# Altium project racecar_shiftlight.PrjPcb
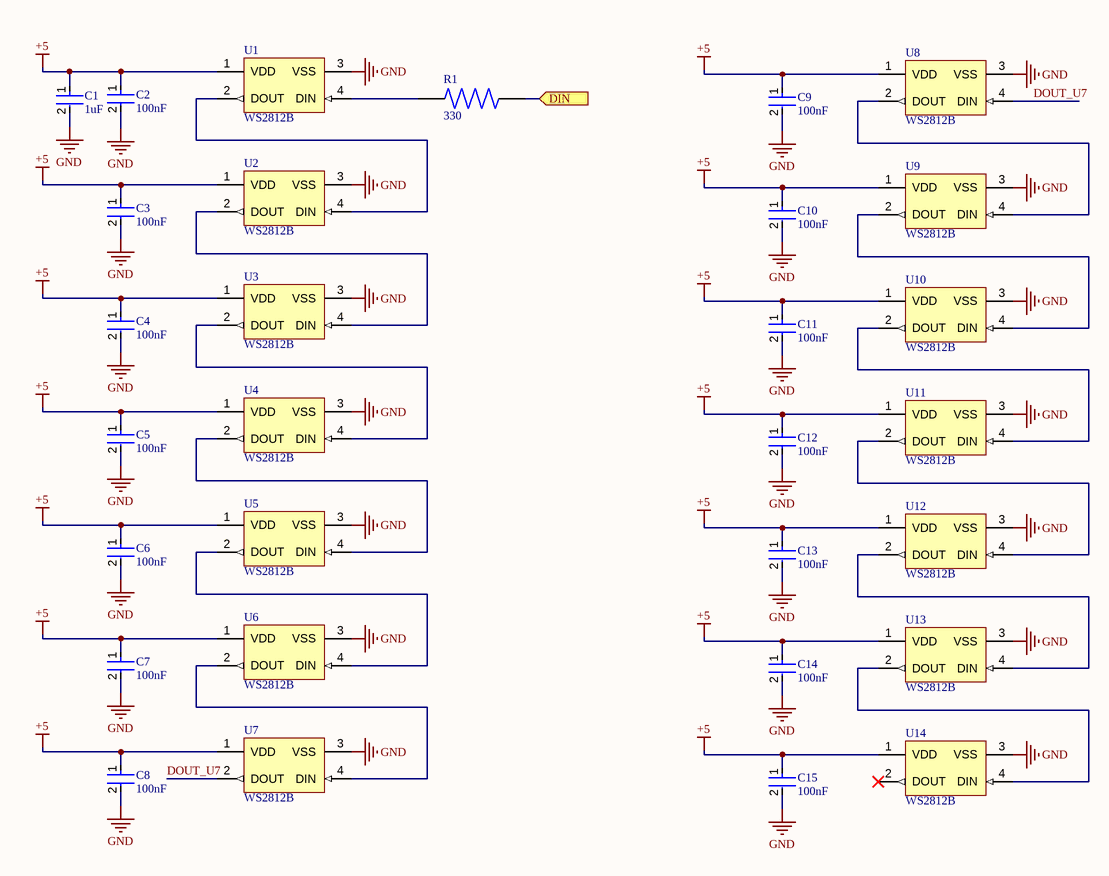
[diagram p0: ws2812b.SchDoc]
CAGE_CODE: ?????; CONTRACT_NUMBER: <CONTRACT NO>; DOC_NO_ASSY_DWG: <ASSY DWG NO>; DOC_NO_BOM: <BOM DOC NO>; DOC_NO_FAB_DWG: <FAB DWG NO>; DOC_NO_SCH_DWG: <SCH DWG NO>; PCB_2_DEC_TOL: +/-.01; PCB_3_DEC_TOL: +/-.010; PCB_ANG_TOL: +/-1/2; PCB_ASSEMBLY_NO: <PCB ASSY NO>; PCB_CHECKER: - -----; PCB_CHECKER_APP_DATE: --/--/----; PCB_DESIGNER: - -----; PCB_DESIGNER_APP_DATE: --/--/----; PCB_DWG_NO: <PCB DWG NO>; PCB_ENGINEER: - -----; PCB_ENGINEER_APP_DATE: --/--/----; PCB_PART_NUMBER: <PCB PN>; PCB_REV: A; SCH_REV: A
3 sheets, 53 parts. Net scope: flat (ports and power ports of the same name join across sheets).
Board file: PCB1.PcbDoc
Sheets:
  ws2812b.SchDoc
  7_seg_display.SchDoc
  connectors_and_mosfets.SchDoc

## Sheet ws2812b.SchDoc: WS2812B
size Letter; Author: Lin Fu; SheetNumber: 1; SheetTotal: 3; ENG_APP_DATE: --/--/--; DSN_APP_DATE: --/--/--; CHK_APP_DATE: --/--/--

### Parts
C1  1uF  [FP-CGA3E-0_3-0_1-IPC_A]
C2  100nF  [FP-CL10-IPC_A]
C3  100nF  [FP-CL10-IPC_A]
C4  100nF  [FP-CL10-IPC_A]
C5  100nF  [FP-CL10-IPC_A]
C6  100nF  [FP-CL10-IPC_A]
C7  100nF  [FP-CL10-IPC_A]
C8  100nF  [FP-CL10-IPC_A]
C9  100nF  [FP-CL10-IPC_A]
C10  100nF  [FP-CL10-IPC_A]
C11  100nF  [FP-CL10-IPC_A]
C12  100nF  [FP-CL10-IPC_A]
C13  100nF  [FP-CL10-IPC_A]
C14  100nF  [FP-CL10-IPC_A]
C15  100nF  [FP-CL10-IPC_A]
R1  value 330  [RES_ERJ-PB3B3300V]  (hidden comment: ERJ-PB3B3300V)
U1  WS2812B  [ADAI-WS2812B_V]
U2  WS2812B  [ADAI-WS2812B_V]
U3  WS2812B  [ADAI-WS2812B_V]
U4  WS2812B  [ADAI-WS2812B_V]
U5  WS2812B  [ADAI-WS2812B_V]
U6  WS2812B  [ADAI-WS2812B_V]
U7  WS2812B  [ADAI-WS2812B_V]
U8  WS2812B  [ADAI-WS2812B_V]
U9  WS2812B  [ADAI-WS2812B_V]
U10  WS2812B  [ADAI-WS2812B_V]
U11  WS2812B  [ADAI-WS2812B_V]
U12  WS2812B  [ADAI-WS2812B_V]
U13  WS2812B  [ADAI-WS2812B_V]
U14  WS2812B  [ADAI-WS2812B_V]

### Ports
DIN (in)

### Nets
+5: C1.1 C2.1 C3.1 C4.1 C5.1 C6.1 C7.1 C8.1 C9.1 C10.1 C11.1 C12.1 C13.1 C14.1 C15.1 U1.1(VDD) U2.1(VDD) U3.1(VDD) U4.1(VDD) U5.1(VDD) U6.1(VDD) U7.1(VDD) U8.1(VDD) U9.1(VDD) U10.1(VDD) U11.1(VDD) U12.1(VDD) U13.1(VDD) U14.1(VDD)  [project net 5V]
GND: C1.2 C2.2 C3.2 C4.2 C5.2 C6.2 C7.2 C8.2 C9.2 C10.2 C11.2 C12.2 C13.2 C14.2 C15.2 U1.3(VSS) U2.3(VSS) U3.3(VSS) U4.3(VSS) U5.3(VSS) U6.3(VSS) U7.3(VSS) U8.3(VSS) U9.3(VSS) U10.3(VSS) U11.3(VSS) U12.3(VSS) U13.3(VSS) U14.3(VSS)
DIN: R1.2 ; port DIN
DOUT_U7: U7.2(DOUT) U8.4(DIN)
NetR1_1: R1.1 U1.4(DIN)
NetU1_2: U1.2(DOUT) U2.4(DIN)
NetU2_2: U2.2(DOUT) U3.4(DIN)
NetU3_2: U3.2(DOUT) U4.4(DIN)
NetU4_2: U4.2(DOUT) U5.4(DIN)
NetU5_2: U5.2(DOUT) U6.4(DIN)
NetU6_2: U6.2(DOUT) U7.4(DIN)
NetU8_2: U8.2(DOUT) U9.4(DIN)
NetU9_2: U9.2(DOUT) U10.4(DIN)
NetU10_2: U10.2(DOUT) U11.4(DIN)
NetU11_2: U11.2(DOUT) U12.4(DIN)
NetU12_2: U12.2(DOUT) U13.4(DIN)
NetU13_2: U13.2(DOUT) U14.4(DIN)

Not connected (* = marked no-connect by the designer): U14 2(DOUT)*

### Notes on the sheet
- DWG. NO.
- REV.
- SHT.
- THIS DOCUMENT AND THE DATA DISCLOSED HEREIN OR HEREWITH IS THE PROPERTY OF ALTIUM LIMITED AND MAY BE FREELY DISTRIBUTED IN WHOLE. NO RIGHTS ARE RESERVED OR EXPRESS OR IMPLIED WARANTEE GIVEN.
- REVISION
- DESCRIPTION
- DATE
- APPROVED
- ENG:
- APPROVALS
- PROJECT
- DSN:
- CHK:
- REFERENCE DOCUMENTS
- PROJECT REVISION:
- TITLE
- DOCUMENT REVISION:
- DESIGN ITEM:
- BOM:
- FAB DWG:
- PCB DWG:
- ASSY DWG:
- SCALE:
- SIZE
- B
- CAGE CODE
- FILE NAME
- DWG NO.
- SHEET
- OF
- REV

### Library data of the parts
C1 = CMP-08246-002161-1: Cap Ceramic 1uF 16V X7R 10% Pad SMD 0603 +125°C Automotive T/R; Capacitance: 1uF; Package Quantity: 4000; Voltage Rating (DC): 16V; Voltage Rating: 16V; Max Operating Temperature: 125°C; Mount: Surface Mount; Length: 0.063inch; Width: 0.8mm; Weight: 7.1E-05oz; Lead Free: Lead Free; Thickness: 0.035inch; Case/Package: 0603; REACH SVHC: No SVHC; Tolerance: 10%; Min Operating Temperature: -55°C; Termination: SMD/SMT; Case Code (Imperial): 0603; Height: 0.8mm; Case Code (Metric): 1608; Packaging: Tape and Reel; Ratings: AEC-Q200; Dielectric: X7R
C2-C15 = CMP-13271-002683-1: Cap Ceramic 100nF 16V X7R ±10% Pad SMD 0603 +125°C T/R; Voltage Rating: 16V; Max Operating Temperature: 125°C; Capacitance: 100nF; Features: Soft Termination; Length: 0.063inch; Packaging: Tape and Reel; Min Operating Temperature: -55°C; Mount: Surface Mount; Case/Package: 0603; Case Code (Metric): 1608; Width: 0.031inch; Ratings: AEC-Q200; Thickness: 0.035inch; Case Code (Imperial): 0603; Tolerance: 10%
R1 = CMP-009-00177-1: Series/Type: High Precision Thick Film Chip Resistors , Power Rating (W): 0.2, Chip Size (LxW(EIA)) (mm): 1.6 x 0.8 (EIA:0603), Resistance Values (鈩; MF: Panasonic; Availability: In Stock; MP: ERJ-PB3B3300V; Component Type: Standard; Purchase-URL: https://pricing.snapeda.com/search/part/ERJ-PB3B3300V/?ref=eda; Source: ERJ-PB3B3300V.SchLib; Design Item ID: ERJ-PB3B3300V; Pins: 2; SnapEDA_Link: https://www.snapeda.com/parts/ERJ-PB3B3300V/Panasonic/view-part/?ref=snap; Price: None; Case/Package: 603-2 Panasonic; Check_prices: https://www.snapeda.com/parts/ERJ-PB3B3300V/Panasonic/view-part/?ref=eda
U1-U14 = CMP-007-00035-2: Intelligent Control LED Integrated Light Source, 3.5 to 5.3 V, -25 to 80 degC, 4-Pin SMD, RoHS, Bulk; Manufacturer: Adafruit Industries; Datasheet URL: https://cdn-shop.adafruit.com/datasheets/WS2812B.pdf; Manufacturer URL: https://www.adafruit.com/; Datasheet Version: May-13; Case/Package: WS2812B; Mounting Technology: SM; RoHS Compliant: False; Package Description: 4-Pin Surface Mount Device, Body 5 x 5 mm, Pitch 3.3 mm; Package Reference: WS2812B

## Sheet 7_seg_display.SchDoc
size Letter; SheetNumber: 2; SheetTotal: 3
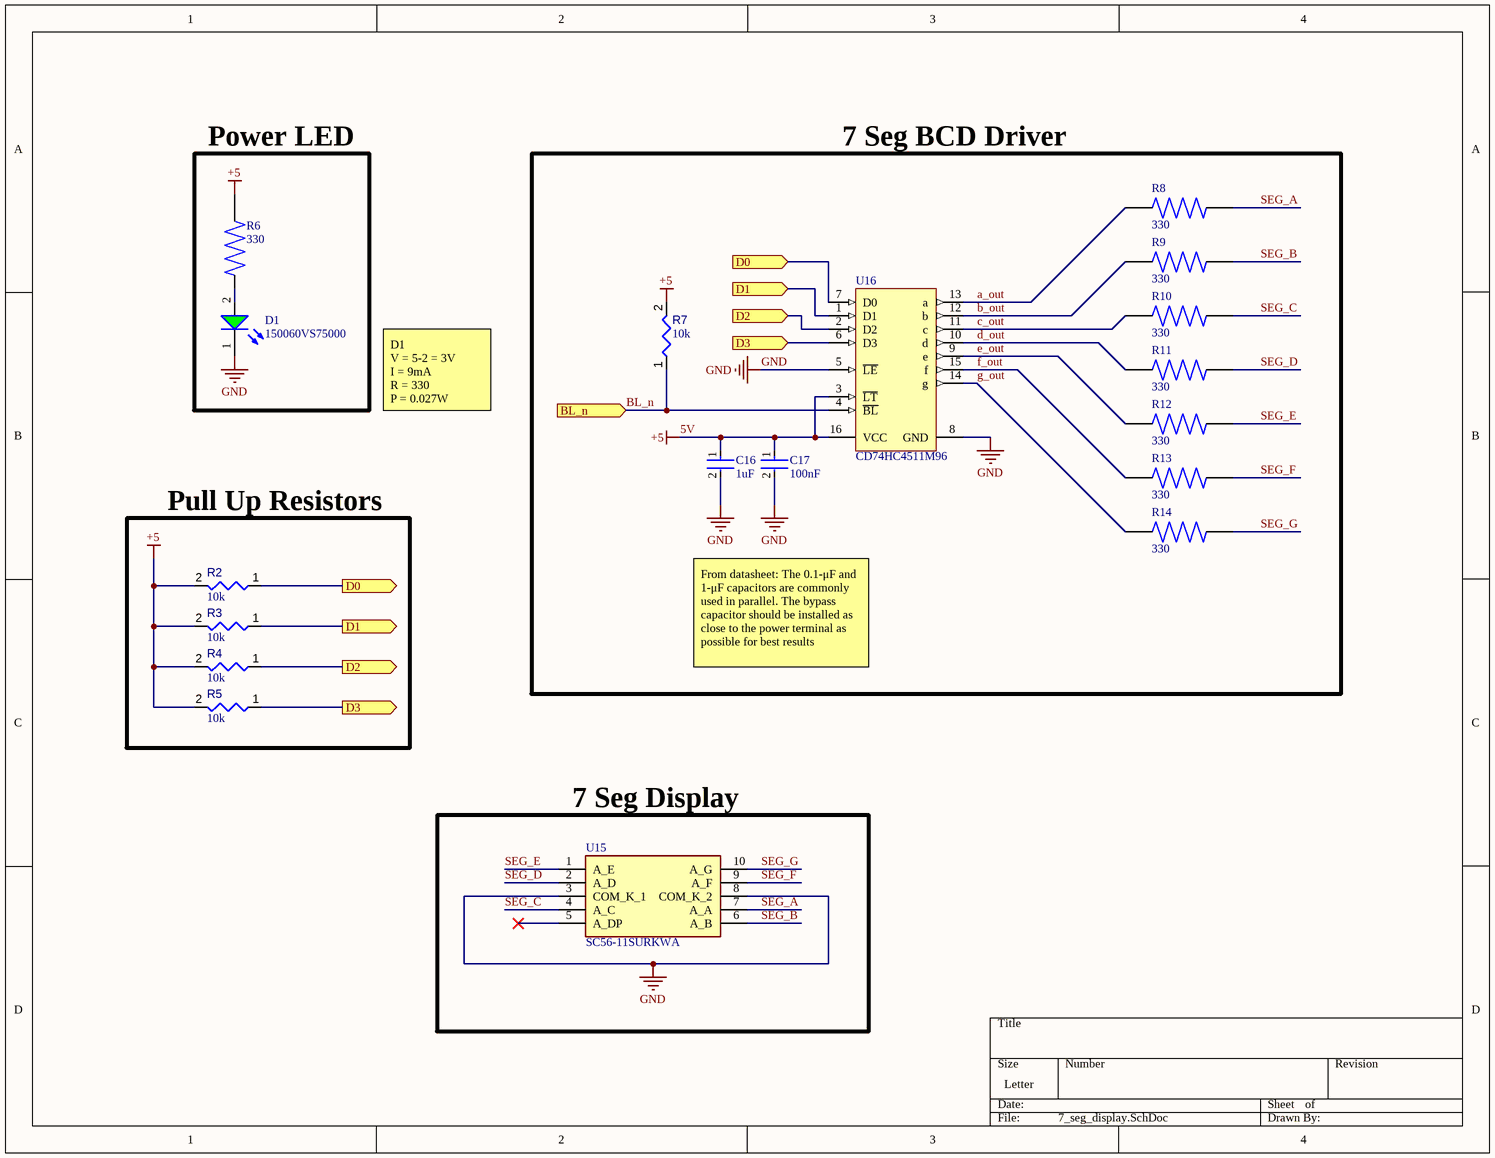
[diagram p1: 7_seg_display.SchDoc]

### Parts
C16  1uF  [FP-CGA3E-0_3-0_1-IPC_A]
C17  100nF  [FP-CL10-IPC_A]
D1  150060VS75000  [WL-SMCW_0603_150060xx75000]
R2  value 10k  [RESC1608X55X25ML10T15]  (hidden comment: Resistor 10k +/-1% 0603 100 mW)
R3  value 10k  [RESC1608X55X25ML10T15]  (hidden comment: Resistor 10k +/-1% 0603 100 mW)
R4  value 10k  [RESC1608X55X25ML10T15]  (hidden comment: Resistor 10k +/-1% 0603 100 mW)
R5  value 10k  [RESC1608X55X25ML10T15]  (hidden comment: Resistor 10k +/-1% 0603 100 mW)
R6  value 330  [RES_ERJ-PB3B3300V]  (hidden comment: ERJ-PB3B3300V)
R7  value 10k  [RESC1608X55X25ML10T15]  (hidden comment: Resistor 10k +/-1% 0603 100 mW)
R8  value 330  [RES_ERJ-PB3B3300V]  (hidden comment: ERJ-PB3B3300V)
R9  value 330  [RES_ERJ-PB3B3300V]  (hidden comment: ERJ-PB3B3300V)
R10  value 330  [RES_ERJ-PB3B3300V]  (hidden comment: ERJ-PB3B3300V)
R11  value 330  [RES_ERJ-PB3B3300V]  (hidden comment: ERJ-PB3B3300V)
R12  value 330  [RES_ERJ-PB3B3300V]  (hidden comment: ERJ-PB3B3300V)
R13  value 330  [RES_ERJ-PB3B3300V]  (hidden comment: ERJ-PB3B3300V)
R14  value 330  [RES_ERJ-PB3B3300V]  (hidden comment: ERJ-PB3B3300V)
U15  SC56-11SURKWA  [DIPS1524W75P254L1270H825Q10N]
U16  CD74HC4511M96  [D0016A_N]

### Blocks framed on the sheet
Power LED: D1 R6
7 Seg BCD Driver: C16 C17 R7-R14 U16
Pull Up Resistors: R2-R5
7 Seg Display: U15

### Ports
BL_n (in), D0 (in), D0 (out), D1 (in), D1 (out), D2 (in), D2 (out), D3 (in), D3 (out)

### Nets
5V: C16.1 C17.1 R2.2 R3.2 R4.2 R5.2 R6.2 R7.2 U16.3(~{LT}) U16.16(VCC)  [also labelled +5]
GND: C16.2 C17.2 D1.1(K) U15.3(COM_K_1) U15.8(COM_K_2) U16.5(~{LE}) U16.8(GND)
a_out: R8.2 U16.13(a)
b_out: R9.2 U16.12(b)
BL_n: R7.1 U16.4(~{BL}) ; port BL_n
c_out: R10.2 U16.11(c)
d_out: R11.2 U16.10(d)
e_out: R12.2 U16.9(e)
f_out: R13.2 U16.15(f)
g_out: R14.1 U16.14(g)
SEG_A: R8.1 U15.7(A_A)
SEG_B: R9.1 U15.6(A_B)
SEG_C: R10.1 U15.4(A_C)
SEG_D: R11.1 U15.2(A_D)
SEG_E: R12.1 U15.1(A_E)
SEG_F: R13.1 U15.9(A_F)
SEG_G: R14.2 U15.10(A_G)
NetD1_2: D1.2(A) R6.1
NetR2_1: R2.1 U16.7(D0) ; port D0
NetR3_1: R3.1 U16.1(D1) ; port D1
NetR4_1: R4.1 U16.2(D2) ; port D2
NetR5_1: R5.1 U16.6(D3) ; port D3

Not connected (* = marked no-connect by the designer): U15 5(A_DP)*

### Notes on the sheet
- D1
  V = 5-2 = 3V
  I = 9mA
  R = 330
  P = 0.027W
- From datasheet: The 0.1-μF and 1-μF capacitors are commonly used in parallel. The bypass capacitor should be installed as close to the power terminal as possible for best results

### Library data of the parts
C16 = CMP-08246-002161-1: as C1 on sheet ws2812b; Capacitance: 1uF; Package Quantity: 4000; Voltage Rating (DC): 16V; Voltage Rating: 16V; Max Operating Temperature: 125°C; Mount: Surface Mount; Length: 0.063inch; Width: 0.8mm; Weight: 7.1E-05oz; Lead Free: Lead Free; Thickness: 0.035inch; Case/Package: 0603; REACH SVHC: No SVHC; Tolerance: 10%; Min Operating Temperature: -55°C; Termination: SMD/SMT; Case Code (Imperial): 0603; Height: 0.8mm; Case Code (Metric): 1608; Packaging: Tape and Reel; Ratings: AEC-Q200; Dielectric: X7R
C17 = CMP-13271-002683-1: as C2 on sheet ws2812b; Voltage Rating: 16V; Max Operating Temperature: 125°C; Capacitance: 100nF; Features: Soft Termination; Length: 0.063inch; Packaging: Tape and Reel; Min Operating Temperature: -55°C; Mount: Surface Mount; Case/Package: 0603; Case Code (Metric): 1608; Width: 0.031inch; Ratings: AEC-Q200; Thickness: 0.035inch; Case Code (Imperial): 0603; Tolerance: 10%
D1 = CMP-1426-00006-7: WURTH ELEKTRONIK - 150060VS75000 - LED, Green, SMD, 0603, 30 mA, 2 V, 570 nm; Reverse Voltage: 5V; Power Dissipation: 72mW; Dominant Wavelength: 570nm; Peak Wavelength: 572nm; Forward Current: 100mA; Forward Voltage: 2V; Lens Style: Clear, Rectangular; Test Current: 20mA; Max Junction Temperature (Tj): 95°C; Viewing Angle: 140°; Luminous Intensity: 40mcd; Height: 700µm; Width: 800µm; Length: 1.6mm; Mount: Surface Mount; Min Operating Temperature: -40°C; Max Reverse Voltage (DC): 5V; Case Code (Imperial): 0603; Wavelength: 570nm; Color: Green; REACH SVHC: Unknown; RoHS: Compliant; Max Operating Temperature: 85°C; Packaging: Tape and Reel; Case/Package: 0603; Number of Pins: 2; Case Code (Metric): 1608
R2-R5 R7 = CMP-009-00017-5: Chip Resistor, 10 KOhm, +/- 1%, 01 W, -55 to 155 degC, 0603 (1608 Metric); Voltage Rating: 50V; Power: 100mW; RoHS Compliant: True; Min Operating Temperature: -55°C; Pins: 2; Case/Package: 0603; Mounting Technology: SM; Max Operating Temperature: 155°C; Tolerance: 1%
R6 R8-R14 = CMP-009-00177-1: as R1 on sheet ws2812b; Availability: In Stock; MP: ERJ-PB3B3300V; Component Type: Standard; Purchase-URL: https://pricing.snapeda.com/search/part/ERJ-PB3B3300V/?ref=eda; Source: ERJ-PB3B3300V.SchLib; Design Item ID: ERJ-PB3B3300V; Pins: 2; SnapEDA_Link: https://www.snapeda.com/parts/ERJ-PB3B3300V/Panasonic/view-part/?ref=snap; Price: None; Case/Package: 603-2 Panasonic; Check_prices: https://www.snapeda.com/parts/ERJ-PB3B3300V/Panasonic/view-part/?ref=eda
  R8: ComponentLink1Description: Digikey; ComponentLink1URL: https://www.digikey.ca/en/products/detail/panasonic-electronic-components/ERJ-PB3B3300V/6212698
U15 = SC56-11SURKWA: Display; Manufacturer_Name: Kingbright; Datasheet Link: https://www.kingbrightusa.com/images/catalog/SPEC/SC56-11SURKWA.pdf; Height: 8.25mm; Manufacturer_Part_Number: SC56-11SURKWA; Mouser Part Number: 604-SC56-11SURKWA; Mouser Price/Stock: https://www.mouser.co.uk/ProductDetail/Kingbright/SC56-11SURKWA?qs=FRBiz4Wv1YPfPJAshkDmnw%3D%3D; Arrow Part Number: SC56-11SURKWA; Arrow Price/Stock: https://www.arrow.com/en/products/sc56-11surkwa/kingbright?region=europe
U16 = CMP-0388-00023-2: High Speed CMOS Logic BCD-to-7-Segment Latch / Decoder / Driver, 2 to 6 V, -55 to 125 degC, 16-pin SOIC (D16), Green (RoHS & no Sb/Br); Manufacturer: Texas Instruments; Vin(Min)(V): 2; Vin(Max)(V): 6; SubFamily: Discrete Segment LED Driver; Rating: Catalog; PackageVersion: 4040047-6/M; ComponentLink1Description: Manufacturer URL; ComponentLink3URL: http://www.ti.com/litv/pdf/mpds178g; ComponentLink2URL: http://www.ti.com/general/docs/lit/getliterature.tsp?genericPartNumber=CD74HC4511&fileType=pdf; PartNumber: CD74HC4511M96; ComponentLink1URL: http://www.ti.com/; Code_JEDEC: MS-012; DatasheetVersion: SCHS279D; ComponentLink2Description: Datasheet; Mounting Technology: Surface Mount; PackageReference: D0016A; Eco-Plan: Green (RoHS & no Sb/Br); PackageDescription: 16-Pin Plastic Small Outline, Body 9.90 x 3.90 mm, Pitch 1.27 mm; ComponentLink3Description: Package Specification

## Sheet connectors_and_mosfets.SchDoc
size Letter; SheetNumber: 3; SheetTotal: 3
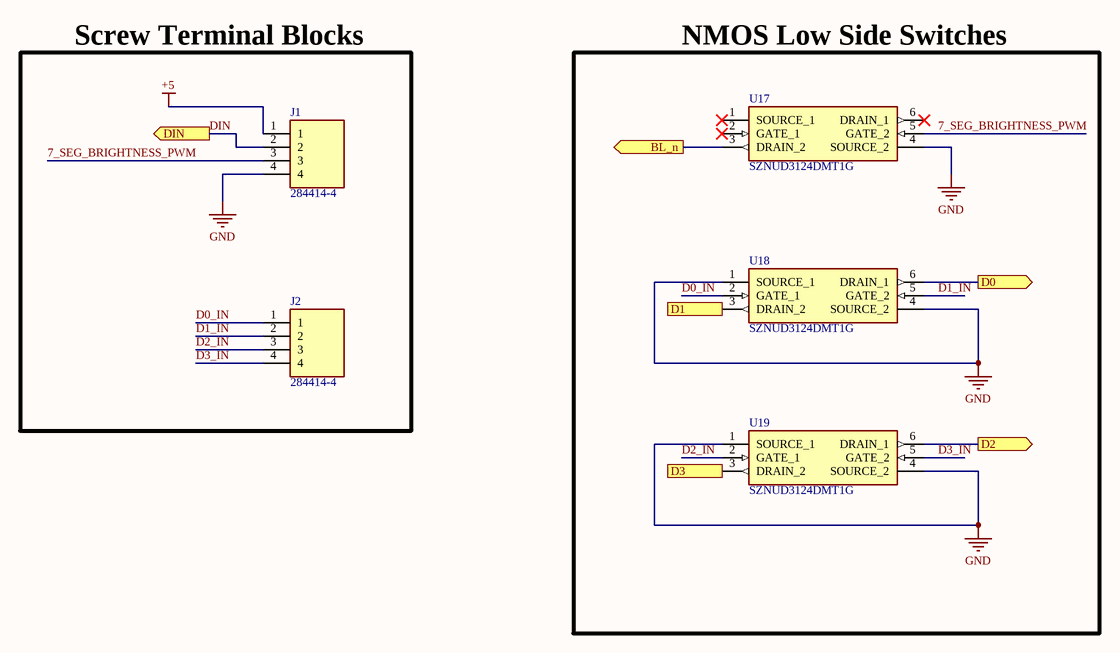
[diagram p2: connectors_and_mosfets.SchDoc]

### Parts
J1  284414-4  [2844144]
J2  284414-4  [2844144]
U17  SZNUD3124DMT1G  [SOT95P275X110-6N]
U18  SZNUD3124DMT1G  [SOT95P275X110-6N]
U19  SZNUD3124DMT1G  [SOT95P275X110-6N]

### Blocks framed on the sheet
Screw Terminal Blocks: J1 J2
NMOS Low Side Switches: U17-U19

### Ports
BL_n (out), D0 (out), D1 (out), D2 (out), D3 (out), DIN (out)

### Nets
+5: J1.1  [project net 5V]
GND: J1.4 U17.4(SOURCE_2) U18.1(SOURCE_1) U18.4(SOURCE_2) U19.1(SOURCE_1) U19.4(SOURCE_2)
7_SEG_BRIGHTNESS_PWM: J1.3 U17.5(GATE_2)
BL_n: U17.3(DRAIN_2) ; port BL_n
D0_IN: J2.1 U18.2(GATE_1)
D1_IN: J2.2 U18.5(GATE_2)
D2_IN: J2.3 U19.2(GATE_1)
D3_IN: J2.4 U19.5(GATE_2)
DIN: J1.2 ; port DIN
NetR2_1: U18.6(DRAIN_1) ; port D0
NetR3_1: U18.3(DRAIN_2) ; port D1
NetR4_1: U19.6(DRAIN_1) ; port D2
NetR5_1: U19.3(DRAIN_2) ; port D3

Not connected (* = marked no-connect by the designer): U17 1(SOURCE_1)* 2(GATE_1)* 6(DRAIN_1)*

### Library data of the parts
J1 J2 = 284414-4: Connector; Manufacturer_Name: TE Connectivity; Datasheet Link: https://www.te.com/commerce/DocumentDelivery/DDEController?Action=srchrtrv&DocNm=1-1773458-1_EURO_STYLE_QRG&DocType=Data%20Sheet&DocLang=English&PartCntxt=284414-4&DocFormat=pdf; Height: 8.35mm; Manufacturer_Part_Number: 284414-4; Mouser Part Number: 571-284414-4; Mouser Price/Stock: https://www.mouser.co.uk/ProductDetail/TE-Connectivity-AMP/284414-4?qs=pW%2FyRk%2FT1EFQM4dD%252BIL6sA%3D%3D
  J1: ComponentLink1Description: digikey; ComponentLink1URL: https://www.digikey.ca/en/products/detail/te-connectivity-amp-connectors/284414-4/1150171
U17-U19 = SZNUD3124DMT1G: Integrated Circuit; Manufacturer_Name: onsemi; Datasheet Link: https://componentsearchengine.com/Datasheets/2/SZNUD3124DMT1G.pdf; Height: 1.1mm; Manufacturer_Part_Number: SZNUD3124DMT1G; Mouser Part Number: 863-SZNUD3124DMT1G; Mouser Price/Stock: https://www.mouser.co.uk/ProductDetail/onsemi/SZNUD3124DMT1G?qs=uarJZ6H%252BeNp%2Fh61aNCid3w%3D%3D; Arrow Part Number: SZNUD3124DMT1G; Arrow Price/Stock: https://www.arrow.com/en/products/sznud3124dmt1g/on-semiconductor?region=nac

## Nets that join several sheets
5V: ws2812b (29 pins), 7_seg_display (10 pins), connectors_and_mosfets (J1.1)
GND: ws2812b (29 pins), 7_seg_display (7 pins), connectors_and_mosfets (6 pins)
BL_n: 7_seg_display (R7.1 U16.4), connectors_and_mosfets (U17.3)
DIN: ws2812b (R1.2), connectors_and_mosfets (J1.2)
NetR2_1: 7_seg_display (R2.1 U16.7), connectors_and_mosfets (U18.6)
NetR3_1: 7_seg_display (R3.1 U16.1), connectors_and_mosfets (U18.3)
NetR4_1: 7_seg_display (R4.1 U16.2), connectors_and_mosfets (U19.6)
NetR5_1: 7_seg_display (R5.1 U16.6), connectors_and_mosfets (U19.3)